# Altium schematic sheet 10_SDADC.SchDoc
size 420 x 297 mm; SheetNumber: 10; SheetTotal: 12
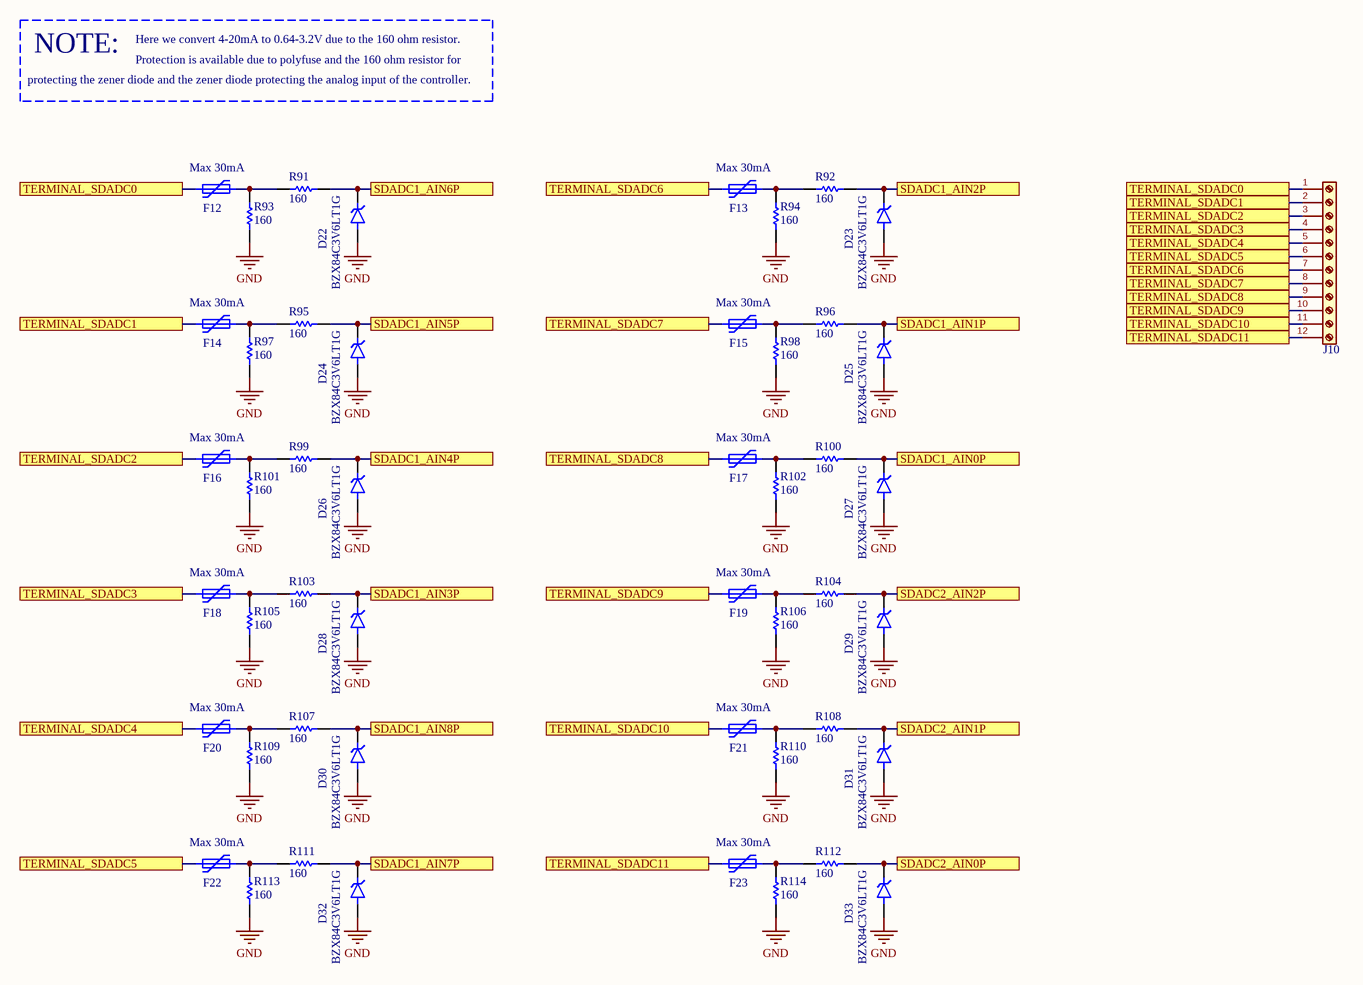
[diagram p0: 10_SDADC.SchDoc]

## Parts
D22  BZX84C3V6LT1G  [SOT95P240X111-3N]
D23  BZX84C3V6LT1G  [SOT95P240X111-3N]
D24  BZX84C3V6LT1G  [SOT95P240X111-3N]
D25  BZX84C3V6LT1G  [SOT95P240X111-3N]
D26  BZX84C3V6LT1G  [SOT95P240X111-3N]
D27  BZX84C3V6LT1G  [SOT95P240X111-3N]
D28  BZX84C3V6LT1G  [SOT95P240X111-3N]
D29  BZX84C3V6LT1G  [SOT95P240X111-3N]
D30  BZX84C3V6LT1G  [SOT95P240X111-3N]
D31  BZX84C3V6LT1G  [SOT95P240X111-3N]
D32  BZX84C3V6LT1G  [SOT95P240X111-3N]
D33  BZX84C3V6LT1G  [SOT95P240X111-3N]
F12  Max 30mA  [Fuse_0603_1608Metric]
F13  Max 30mA  [Fuse_0603_1608Metric]
F14  Max 30mA  [Fuse_0603_1608Metric]
F15  Max 30mA  [Fuse_0603_1608Metric]
F16  Max 30mA  [Fuse_0603_1608Metric]
F17  Max 30mA  [Fuse_0603_1608Metric]
F18  Max 30mA  [Fuse_0603_1608Metric]
F19  Max 30mA  [Fuse_0603_1608Metric]
F20  Max 30mA  [Fuse_0603_1608Metric]
F21  Max 30mA  [Fuse_0603_1608Metric]
F22  Max 30mA  [Fuse_0603_1608Metric]
F23  Max 30mA  [Fuse_0603_1608Metric]
J10  Terminal_01x12_P5.00  [TerminalBlock_Phoenix_PT-1,5-12-5.0-H_1x12_P5.00mm_Horizontal]  (value not drawn)
R91  ValueDisplayed: 160  [0603]  (hidden comment: CRCW060320R0JNEA)
R92  ValueDisplayed: 160  [0603]  (hidden comment: CRCW060320R0JNEA)
R93  ValueDisplayed: 160  [0603]  (hidden comment: CRCW060320R0JNEA)
R94  ValueDisplayed: 160  [0603]  (hidden comment: CRCW060320R0JNEA)
R95  ValueDisplayed: 160  [0603]  (hidden comment: CRCW060320R0JNEA)
R96  ValueDisplayed: 160  [0603]  (hidden comment: CRCW060320R0JNEA)
R97  ValueDisplayed: 160  [0603]  (hidden comment: CRCW060320R0JNEA)
R98  ValueDisplayed: 160  [0603]  (hidden comment: CRCW060320R0JNEA)
R99  ValueDisplayed: 160  [0603]  (hidden comment: CRCW060320R0JNEA)
R100  ValueDisplayed: 160  [0603]  (hidden comment: CRCW060320R0JNEA)
R101  ValueDisplayed: 160  [0603]  (hidden comment: CRCW060320R0JNEA)
R102  ValueDisplayed: 160  [0603]  (hidden comment: CRCW060320R0JNEA)
R103  ValueDisplayed: 160  [0603]  (hidden comment: CRCW060320R0JNEA)
R104  ValueDisplayed: 160  [0603]  (hidden comment: CRCW060320R0JNEA)
R105  ValueDisplayed: 160  [0603]  (hidden comment: CRCW060320R0JNEA)
R106  ValueDisplayed: 160  [0603]  (hidden comment: CRCW060320R0JNEA)
R107  ValueDisplayed: 160  [0603]  (hidden comment: CRCW060320R0JNEA)
R108  ValueDisplayed: 160  [0603]  (hidden comment: CRCW060320R0JNEA)
R109  ValueDisplayed: 160  [0603]  (hidden comment: CRCW060320R0JNEA)
R110  ValueDisplayed: 160  [0603]  (hidden comment: CRCW060320R0JNEA)
R111  ValueDisplayed: 160  [0603]  (hidden comment: CRCW060320R0JNEA)
R112  ValueDisplayed: 160  [0603]  (hidden comment: CRCW060320R0JNEA)
R113  ValueDisplayed: 160  [0603]  (hidden comment: CRCW060320R0JNEA)
R114  ValueDisplayed: 160  [0603]  (hidden comment: CRCW060320R0JNEA)

## Ports
SDADC1_AIN0P (see 04_STM32F373VBTx[5C]), SDADC1_AIN1P (see 04_STM32F373VBTx[5C]), SDADC1_AIN2P (see 04_STM32F373VBTx[5C]), SDADC1_AIN3P (see 04_STM32F373VBTx[5C]), SDADC1_AIN4P (see 04_STM32F373VBTx[6B]), SDADC1_AIN5P (see 04_STM32F373VBTx[6B]), SDADC1_AIN6P (see 04_STM32F373VBTx[6B]), SDADC1_AIN7P (see 04_STM32F373VBTx[5C]), SDADC1_AIN8P (see 04_STM32F373VBTx[5C]), SDADC2_AIN0P (see 04_STM32F373VBTx[5C]), SDADC2_AIN1P (see 04_STM32F373VBTx[5C]), SDADC2_AIN2P (see 04_STM32F373VBTx[5C]), TERMINAL_SDADC0 (see 10_SDADC[1A]), TERMINAL_SDADC0 (see 10_SDADC[4A]), TERMINAL_SDADC1 (see 10_SDADC[1A]), TERMINAL_SDADC1 (see 10_SDADC[4A]), TERMINAL_SDADC2 (see 10_SDADC[1B]), TERMINAL_SDADC2 (see 10_SDADC[4A]), TERMINAL_SDADC3 (see 10_SDADC[1B]), TERMINAL_SDADC3 (see 10_SDADC[4A]), TERMINAL_SDADC4 (see 10_SDADC[1B]), TERMINAL_SDADC4 (see 10_SDADC[4A]), TERMINAL_SDADC5 (see 10_SDADC[1C]), TERMINAL_SDADC5 (see 10_SDADC[4A]), TERMINAL_SDADC6 (see 10_SDADC[2A]), TERMINAL_SDADC6 (see 10_SDADC[4A]), TERMINAL_SDADC7 (see 10_SDADC[2A]), TERMINAL_SDADC7 (see 10_SDADC[4A]), TERMINAL_SDADC8 (see 10_SDADC[2B]), TERMINAL_SDADC8 (see 10_SDADC[4A]), TERMINAL_SDADC9 (see 10_SDADC[2B]), TERMINAL_SDADC9 (see 10_SDADC[4A]), TERMINAL_SDADC10 (see 10_SDADC[2B]), TERMINAL_SDADC10 (see 10_SDADC[4A]), TERMINAL_SDADC11 (see 10_SDADC[2C]), TERMINAL_SDADC11 (see 10_SDADC[4A])

## Nets
GND: D22.1(A) D23.1(A) D24.1(A) D25.1(A) D26.1(A) D27.1(A) D28.1(A) D29.1(A) D30.1(A) D31.1(A) D32.1(A) D33.1(A) R93.1 R94.1 R97.1 R98.1 R101.1 R102.1 R105.1 R106.1 R109.1 R110.1 R113.1 R114.1
SDADC1_AIN0P: D27.3(K) R100.2 ; port SDADC1_AIN0P
SDADC1_AIN1P: D25.3(K) R96.2 ; port SDADC1_AIN1P
SDADC1_AIN2P: D23.3(K) R92.2 ; port SDADC1_AIN2P
SDADC1_AIN3P: D28.3(K) R103.2 ; port SDADC1_AIN3P
SDADC1_AIN4P: D26.3(K) R99.2 ; port SDADC1_AIN4P
SDADC1_AIN5P: D24.3(K) R95.2 ; port SDADC1_AIN5P
SDADC1_AIN6P: D22.3(K) R91.2 ; port SDADC1_AIN6P
SDADC1_AIN7P: D32.3(K) R111.2 ; port SDADC1_AIN7P
SDADC1_AIN8P: D30.3(K) R107.2 ; port SDADC1_AIN8P
SDADC2_AIN0P: D33.3(K) R112.2 ; port SDADC2_AIN0P
SDADC2_AIN1P: D31.3(K) R108.2 ; port SDADC2_AIN1P
SDADC2_AIN2P: D29.3(K) R104.2 ; port SDADC2_AIN2P
TERMINAL_SDADC0: F12.1 J10.1(Pin_1) ; port TERMINAL_SDADC0
TERMINAL_SDADC1: F14.1 J10.2(Pin_2) ; port TERMINAL_SDADC1
TERMINAL_SDADC2: F16.1 J10.3(Pin_3) ; port TERMINAL_SDADC2
TERMINAL_SDADC3: F18.1 J10.4(Pin_4) ; port TERMINAL_SDADC3
TERMINAL_SDADC4: F20.1 J10.5(Pin_5) ; port TERMINAL_SDADC4
TERMINAL_SDADC5: F22.1 J10.6(Pin_6) ; port TERMINAL_SDADC5
TERMINAL_SDADC6: F13.1 J10.7(Pin_7) ; port TERMINAL_SDADC6
TERMINAL_SDADC7: F15.1 J10.8(Pin_8) ; port TERMINAL_SDADC7
TERMINAL_SDADC8: F17.1 J10.9(Pin_9) ; port TERMINAL_SDADC8
TERMINAL_SDADC9: F19.1 J10.10(Pin_10) ; port TERMINAL_SDADC9
TERMINAL_SDADC10: F21.1 J10.11(Pin_11) ; port TERMINAL_SDADC10
TERMINAL_SDADC11: F23.1 J10.12(Pin_12) ; port TERMINAL_SDADC11
NetF12_2: F12.2 R91.1 R93.2
NetF13_2: F13.2 R92.1 R94.2
NetF14_2: F14.2 R95.1 R97.2
NetF15_2: F15.2 R96.1 R98.2
NetF16_2: F16.2 R99.1 R101.2
NetF17_2: F17.2 R100.1 R102.2
NetF18_2: F18.2 R103.1 R105.2
NetF19_2: F19.2 R104.1 R106.2
NetF20_2: F20.2 R107.1 R109.2
NetF21_2: F21.2 R108.1 R110.2
NetF22_2: F22.2 R111.1 R113.2
NetF23_2: F23.2 R112.1 R114.2

## Notes on the sheet
- protecting the zener diode and the zener diode protecting the analog input of the controller.
- NOTE:
- Here we convert 4-20mA to 0.64-3.2V due to the 160 ohm resistor.
- Protection is available due to polyfuse and the 160 ohm resistor for
- Sub-system:
- Project:
- Design by:
- Sheet title:
- Sheet
- of
- Checked by:
- Approved by:
- Doc No:
- Revision:
- Size:
- Date:
- A3

## Library data of the parts
D22-D33 = BZX84C3V6LT1G: MP: BZX84C10LT1G; Package: None; Price: None; Value: *; Availability: Unavailable
F12-F23 = Polyfuse 0603
R91-R114 = RES 160R 0603: RES, 160, 5%, 0.1 W, AEC-Q200 Grade 0, 0603; Manufacturer: Vishay-Dale; Power_W: 100mW; TempCo: 200 ppm/C; Value_Code: 20R0; Value: 20; EIA_Code: E24; SizeX_mm: 1.6; SizeY_mm: 0.8; SizeZ_mm: 1; Value2: 0.1W; SizeArea_mm2: 1.28; CompType: Resistor; AEC Qualified: Y; VDC_V: 75V; AEC Category: Q200; AEC Grade: 0; Supplier Part Number 2: 59M6784; Supplier 2: Newark; Supplier Part Number 3: 71-CRCW0603J-20-E3; Supplier 3: Mouser; RoHS: E; Value1: 5%; MountType: SMT; Supplier 1: Digi-Key; PackageReference: 0603; Tolerance_%: 5%; Res_ohm: 20; PartNumber: CRCW060320R0JNEA; ComponentLink1Description: Datasheet link; Supplier Part Number 1: 541-20GCT-ND; Technology: Thick Film; ComponentLink1URL: http://www.vishay.com/docs/20035/dcrcwe3.pdf